# EAGLE design led_board (EAGLE 6.1)
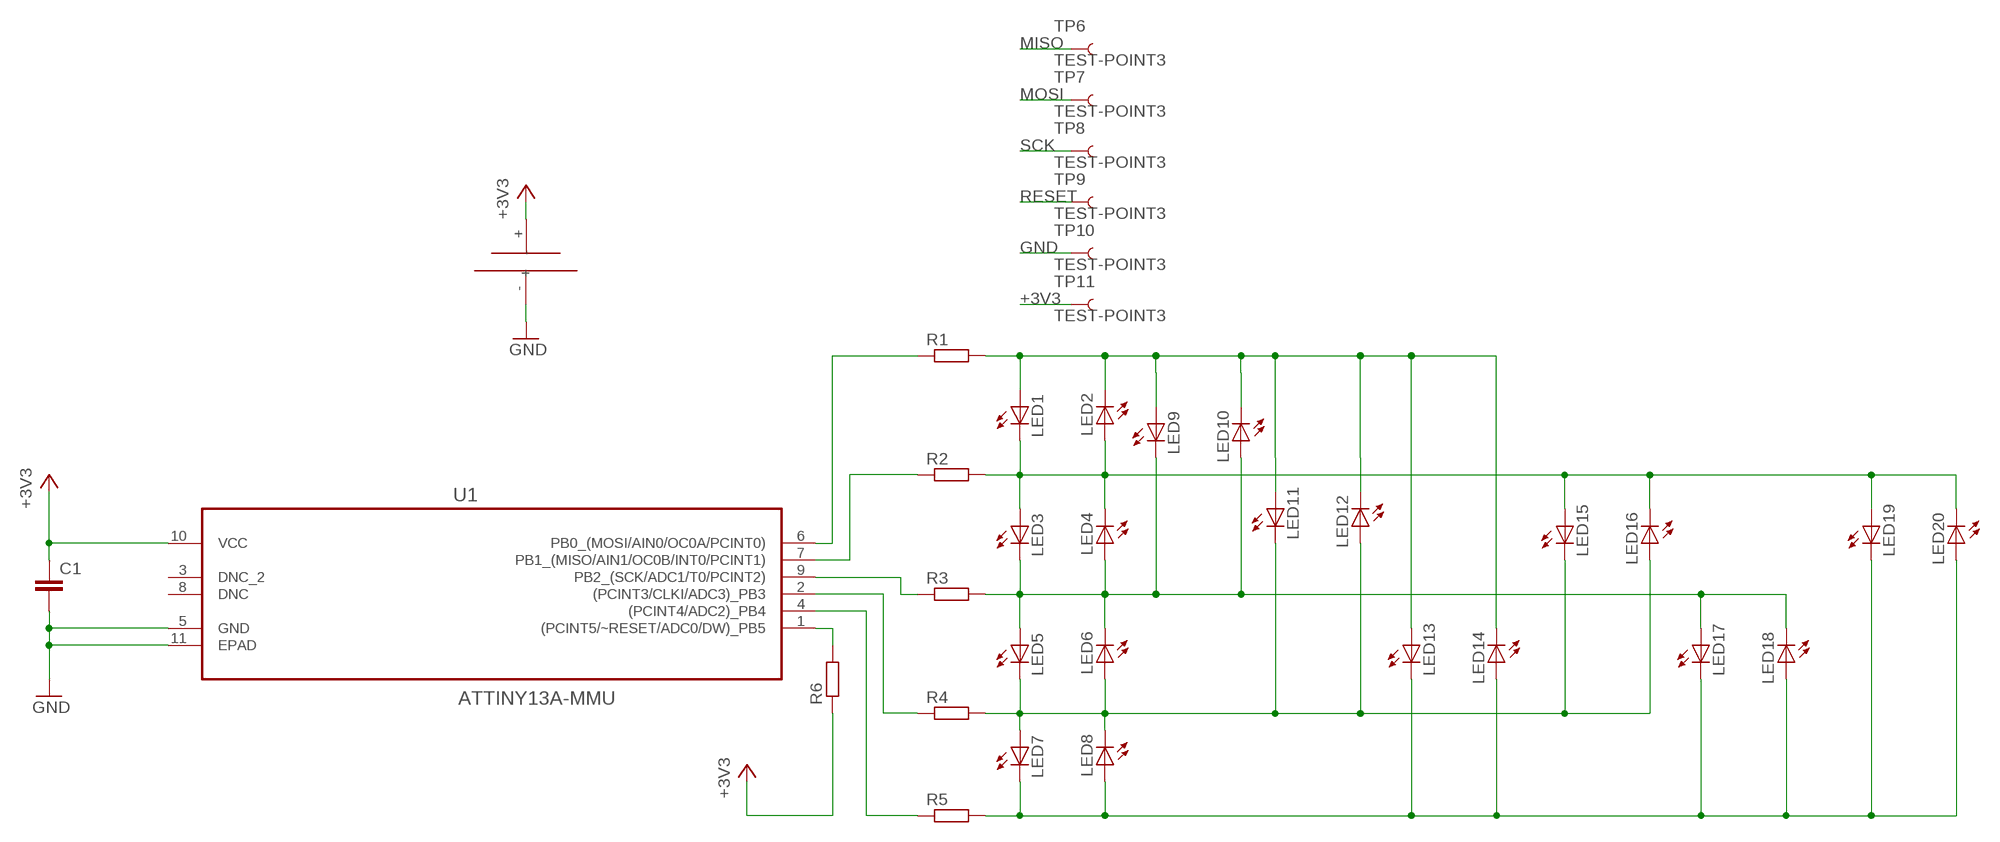
[diagram p0: schematic, sheet 1]

## Parts
C1  C-EUC0603  [C0603]
LED1  LED0603  [LED-0603]
LED2  LED0603  [LED-0603]
LED3  LED0603  [LED-0603]
LED4  LED0603  [LED-0603]
LED5  LED0603  [LED-0603]
LED6  LED0603  [LED-0603]
LED7  LED0603  [LED-0603]
LED8  LED0603  [LED-0603]
LED9  LED0603  [LED-0603]
LED10  LED0603  [LED-0603]
LED11  LED0603  [LED-0603]
LED12  LED0603  [LED-0603]
LED13  LED0603  [LED-0603]
LED14  LED0603  [LED-0603]
LED15  LED0603  [LED-0603]
LED16  LED0603  [LED-0603]
LED17  LED0603  [LED-0603]
LED18  LED0603  [LED-0603]
LED19  LED0603  [LED-0603]
LED20  LED0603  [LED-0603]
R1  R-EU_R0603  [R0603]
R2  R-EU_R0603  [R0603]
R3  R-EU_R0603  [R0603]
R4  R-EU_R0603  [R0603]
R5  R-EU_R0603  [R0603]
R6  R-EU_R0603  [R0603]
TP6  TEST-POINT3  [PAD.03X.03]
TP7  TEST-POINT3  [PAD.03X.03]
TP8  TEST-POINT3  [PAD.03X.03]
TP9  TEST-POINT3  [PAD.03X.03]
TP10  TEST-POINT3  [PAD.03X.03]
TP11  TEST-POINT3  [PAD.03X.03]
U1  ATTINY13A-MMU  [DFN300X300X100-11N]
U$1  BH500  [BAT1220_BH500]

## Nets
+3V3: C1.1 R6.1 TP11.P$1 U1.10(VCC) U$1.+
GND: C1.2 TP10.P$1 U1.5(GND) U1.11(EPAD) U$1.-
MISO: R2.1 TP6.P$1 U1.7(PB1_(MISO/AIN1/OC0B/INT0/PCINT1))
MOSI: R1.1 TP7.P$1 U1.6(PB0_(MOSI/AIN0/OC0A/PCINT0))
N$1: LED5.C LED6.A LED7.A LED8.C LED11.C LED12.A LED15.C LED16.A R4.2
N$2: LED1.C LED2.A LED3.A LED4.C LED15.A LED16.C LED19.A LED20.C R2.2
N$3: LED3.C LED4.A LED5.A LED6.C LED9.C LED10.A LED17.A LED18.C R3.2
N$6: LED7.C LED8.A LED13.C LED14.A LED17.C LED18.A LED19.C LED20.A R5.2
N$7: LED1.A LED2.C LED9.A LED10.C LED11.A LED12.C LED13.A LED14.C R1.2
N$11: R4.1 U1.2((PCINT3/CLKI/ADC3)_PB3)
N$12: R5.1 U1.4((PCINT4/ADC2)_PB4)
RESET: R6.2 TP9.P$1 U1.1((PCINT5/~RESET/ADC0/DW)_PB5)
SCK: R3.1 TP8.P$1 U1.9(PB2_(SCK/ADC1/T0/PCINT2))
Unconnected: U1.3(DNC_2) U1.8(DNC)

## Library data of the parts
C1 = resistor:C-EU: CAPACITOR, European symbol
LED1-LED20 = SparkFun-LED:LED: LEDs Standard schematic elements and footprints for 5mm, 3mm, 1206, and 0603 sized LEDs. 5mm - Spark Fun Electronics SKU : COM-00529 (and others)
R1-R6 = resistor:R-EU_: RESISTOR, European symbol
TP6-TP11 = SparkFun-Passives:TEST-POINT: Bare copper test points for troubleshooting or ICT
U1 = Atmel_By_element14_Batch_1:ATTINY13A-MMU: Microcontroller; DESCRIPTION: Microcontroller; MPN: ATTINY13A-MMU; OC_FARNELL: 1715516; OC_NEWARK: 15R0298; PACKAGE: DFN-10; SUPPLIER: ATMEL
U$1 = SashaLib:BH500

## Board
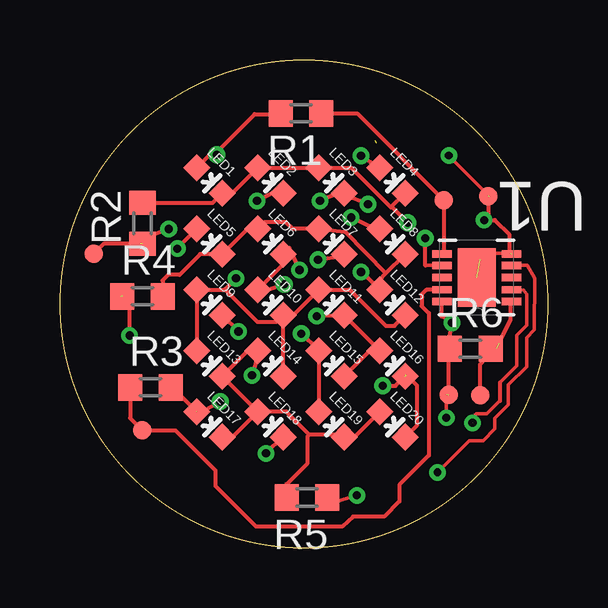
[diagram p1: board, top side]
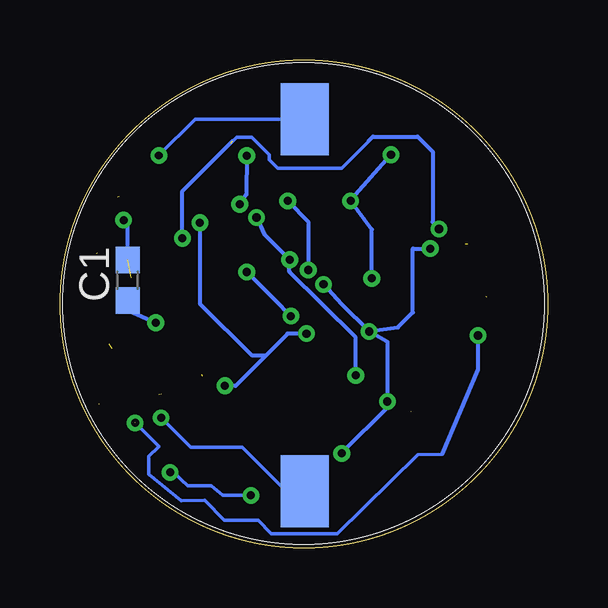
[diagram p2: board, bottom side, seen from below]

Size 20.32 x 20.32 mm. Coordinates in mm from the lower left corner, seen from the top.
Outline: circle at 10.16,10.16 radius 10.16
Copper layers (1*16): Top 0.0356mm / dielectric 1.5011mm / Bottom 0.0356mm
Design rules: minimum track width 6mil, minimum drill 13mil, track to track 6mil, track to pad 6mil, pad to pad 6mil, via to via 6mil, smd to smd 6mil, copper to edge 15mil, drill to drill 6mil, minimum pad ring 7mil, minimum via ring 7mil, stop-mask expansion 3mil, vias tented up to drill 100mil, thermal gap 10mil

### Footprints (pad centres in the part's own frame; a part is rotated, then mirrored left to right if it is on the bottom)
C0603 = smd 1.1 x 1: 1 -0.85,0; 2 0.85,0
LED-0603 = smd 0.8 x 0.8: A 0,-0.75; C 0,0.75
R0603 = smd 1 x 1.1: 1 -0.85,0; 2 0.85,0
PAD.03X.03 = smd 0.762 x 0.762: P$1 0,0
DFN300X300X100-11N = smd 0.813 x 0.305: 1 -1.448,0.991; 2 -1.448,0.508; 3 -1.448,0; 4 -1.448,-0.508; 5 -1.448,-0.991; 6 1.448,-0.991; 7 1.448,-0.508; 8 1.448,0; 9 1.448,0.508; 10 1.448,0.991 | smd 1.575 x 2.438: 11 0,0
BAT1220_BH500 = smd 2 x 3: + 1,1.5; - 1,17

### Placement (x,y rotation side)
C1  17.5,11.14 90 bottom
LED1  6.23,15.3 225 top
LED2  8.77,15.3 225 top
LED3  11.31,15.3 225 top
LED4  13.85,15.3 225 top
LED5  6.23,12.76 225 top
LED6  8.77,12.76 225 top
LED7  11.31,12.76 225 top
LED8  13.85,12.76 225 top
LED9  6.23,10.22 225 top
LED10  8.77,10.22 225 top
LED11  11.31,10.22 225 top
LED12  13.85,10.22 225 top
LED13  6.23,7.68 225 top
LED14  8.77,7.68 225 top
LED15  11.31,7.68 225 top
LED16  13.85,7.68 225 top
LED17  6.23,5.14 225 top
LED18  8.77,5.14 225 top
LED19  11.31,5.14 225 top
LED20  13.85,5.14 225 top
R1  10.04,18.09 180 top
R2  3.44,13.52 90 top
R3  3.77,6.68 0 top
R4  3.44,10.47 0 top
R5  10.29,2.09 180 top
R6  17.09,8.29 0 top
TP6  1.4,12.25 0 top
TP7  16,14.48 0 top
TP8  3.44,4.89 0 top
TP9  17.5,6.36 0 top
TP10  17.84,14.64 0 top
TP11  16.2,6.37 0 top
U1  17.36,11.25 180 top
U$1  11.13,0.85 0 bottom

### Tracks (layer width: path | path; a pad name or v marks a point on that pad's centre or on a via)
+3V3  (via drill 0.33, 0.34 pad 0.18)  (1 unrouted)
  Top 0.152: v16.1,5.41 16.1,6.38 16.17,6.45
  Top 0.17: U1.10 15.9,9.64 16.39,9.39 v16.33,9.37 16.18,8.58 R6.1 16.2,8.14 TP11.P$1
  Bottom 0.152: U$1.+ 10.9,2.35 12.73,4.18 14.87,4.18 v16.1,5.41
  Bottom 0.17: C1.1 17.5,9.89 v16.33,9.37
GND  (via drill 0.33 pad 0.18, 0.34 pad 0.18)  (3 unrouted)
  Top 0.152: v16.2,16.34 16.2,16.32 17.9,14.62 | 18.76,12.27 17.7,12.27 17.71,12.27 17.71,12.26 18.09,12.26
  Top 0.17: 18.71,12.27 18.71,13.06 18.12,13.65 v17.67,13.65 17.84,13.82 TP10.P$1 | 18.71,12.27 18.71,12.25 | 18.76,12.27 18.71,12.27
  Bottom 0.152: U$1.- 14.69,17.85 v16.2,16.34
  Bottom 0.17: C1.2 17.5,13.48 v17.67,13.65
MISO  (via drill 0.34 pad 0.18)  (2 unrouted)
  Top 0.17: R2.1 1.82,12.67 TP6.P$1 | U1.7 15.22,11.75 v15.22,12.89 | v4.53,13.28 3.56,12.89 3.34,12.67
  Bottom 0.152: 7.46,16.95 7.46,16.93 8.59,15.8 11.24,15.8 11.61,16.17 11.61,16.38 12.33,17.1 12.95,17.1 13.2,16.85
  Bottom 0.17: v15.22,12.89 15.22,14.86 13.13,16.95 | 7.46,16.95 7.28,17.13 5.42,17.13 4.79,16.5 4.79,13.56 v4.53,13.28
MOSI
  Top 0.17: R1.1 12.38,18.09 TP7.P$1 16,12.33 U1.6
N$1  (via drill 0.34 pad 0.18)
  Top 0.17: 13.57,11.43 13.32,11.17 LED12.A 12.58,11.49 v12.54,11.49 | 13.57,11.43 LED8.C | LED15.C 12.9,8.21 LED16.A LED11.C 11.84,9.67 v10.7,9.65 | 13.57,11.43 11.88,13.16 LED7.A 9.69,13.29 9.41,13.57 8.52,13.57 LED6.A 7.82,13.29 LED5.C 5.84,12.23 4.98,11.37 4.51,11.37 4.28,11.14 R4.2
  Bottom 0.17: v10.7,9.65 11.36,10.31 v12.54,11.49
N$2  (via drill 0.34 pad 0.18)  (1 unrouted)
  Top 0.17: LED20.C 14.88,5.11 14.88,6.75 14.42,7.21 14.27,7.21 | LED19.A LED15.A 10.78,8.24 v10.05,8.92 | 13.79,14.18 12.14,15.83 LED3.A LED2.A 7.18,14.77 LED1.C 6.36,14.37 R2.2 | 13.79,14.18 LED4.C | v13.45,6.75 13.97,6.74 LED16.C | 13.79,14.18 13.85,14.18 v14.49,13.54
  Bottom 0.17: v10.05,8.92 10.84,8.92 11.67,8.07 | 11.67,8.07 13,6.74 v13.45,6.75 | v14.49,13.54 14.49,10.17 12.34,8.02 11.72,8.02 11.67,8.07
N$3  (via drill 0.34 pad 0.18)  (1 unrouted)
  Top 0.17: LED4.A 13.15,15.83 12.93,16.05 12.93,16.07 v12.54,16.33 | v12.83,14.31 12,14.64 LED3.C 11.59,14.77 v10.83,14.45 | v9.98,11.57 9.56,12.49 LED6.C 9.3,11.81 LED10.A 8.24,10.63 v9.34,10.97 | LED9.C | LED9.C v7.44,9.01 | v4.89,12.46 5.33,12.92 LED5.A | LED18.C 9.26,4.61 v8.58,3.93 | LED17.A 5.92,5.67 v6.68,6.09 | R3.2 4.68,6.68 LED17.A
  Bottom 0.17: v12.54,16.33 12.55,14.72 v12.83,14.31 | v10.83,14.45 9.98,13.59 v9.98,11.57 | v7.44,9.01 6.24,9.18 5.62,9.8 5.62,12.46 v4.89,12.46 | v9.34,10.97 8.61,10.17 v7.44,9.01 | v8.58,3.93 8.51,4.01 6.67,5.85 6.67,5.91 | 6.67,5.91 6.67,8.58 v7.44,9.01 | v6.68,6.09 6.67,5.91
N$6  (via drill 0.34 pad 0.18)
  Top 0.17: LED20.A 12.26,4.61 LED19.C 11.74,4.71 10.39,4.71 | 10.39,4.71 9.43,5.67 LED18.A | LED18.A 7.18,4.61 LED17.C | LED18.A LED13.C 7.82,8.21 LED14.A 8.24,8.02 v8,7.18 | LED8.A 12.92,13.38 v12.13,13.76 | v10.75,12 11.78,12.17 LED7.C | R5.2 9.44,2.64 10.32,3.52 10.32,4.64 10.39,4.71
  Bottom 0.17: v12.13,13.76 11.8,13.06 v10.75,12 10.76,12.02 10.76,11.5 8,8.76 v8,7.18
N$7  (via drill 0.34 pad 0.18)
  Top 0.17: LED14.C LED10.C | LED13.A LED9.A 6.88,10.75 | 6.88,10.75 8.22,9.41 9.02,9.41 LED10.C | LED10.C 9.72,9.69 LED11.A 12.07,10.75 13.58,9.24 13.93,9.24 LED12.C | LED2.C 8.84,14.77 v8.21,14.45 | LED1.A 6.24,16.37 v6.53,16.37 6.53,16.48 8.11,18.06 9.16,18.06 R1.2 | 6.88,10.75 6.88,10.77 v7.33,11.22
  Bottom 0.17: v6.53,16.37 8.18,14.51 v8.21,14.45 7.33,13.26 v7.33,11.22
N$11  (via drill 0.34 pad 0.18)  (2 unrouted)
  Top 0.152: U1.2 19.33,10.73 19.45,10.57 19.45,9.27 19.04,8.85 19.04,7.59 18.33,6.88 | 18.33,6.12 17.79,5.58 17.34,5.58 17.2,5.44 v17.2,5.21
  Top 0.17: 18.33,6.88 18.33,6.12 | v2.9,8.84 2.9,10.1 2.54,10.46
  Bottom 0.152: 4.4,3.9 5.42,3.88 8.77,0.58 11.51,0.58 12.07,1.15 12.81,1.15 13.47,1.15 14.29,1.97 15.27,1.96 16.61,3.05 16.62,3.8 16.21,4.21 16.21,4.22 v17.19,5.2
  Bottom 0.17: 4.4,3.9 2.9,7.44 v2.9,8.84
N$12  (via drill 0.33 pad 0.18)  (1 unrouted)
  Top 0.152: U1.4 19.47,11.76 19.78,11.23 19.77,9.07 19.45,8.75 19.45,7.54 18.68,6.78 18.68,5.99 | 18.68,5.98 18.67,5.95 18.12,5.4 18.12,4.95 17.63,4.46 17.05,4.46 v15.73,3.14 | v12.37,2.18 11.36,1.88 R5.1
  Bottom 0.152: v15.73,3.14 15.61,3.14 14.99,2.59 14.01,2.59 13.53,2.19 12.5,2.19 v12.37,2.18
RESET  (1 unrouted)
  Top 0.17: R6.2 18.17,8.3 18.78,9.49 18.78,10.23 U1.1 | TP9.P$1 17.5,7.64 18.28,8.49
SCK
  Top 0.17: U1.9 15.26,10.74 15.07,10.55 15.07,10.07 15.37,9.77 15.37,3.85 14.14,2.62 14.14,1.93 13.5,1.29 12.21,1.29 11.75,0.88 8.17,0.88 6.47,2.58 6.47,3.22 4.8,4.89 TP8.P$1 2.92,5.4 R3.1